# EAGLE design TEMP sensor (EAGLE 9.6.0)
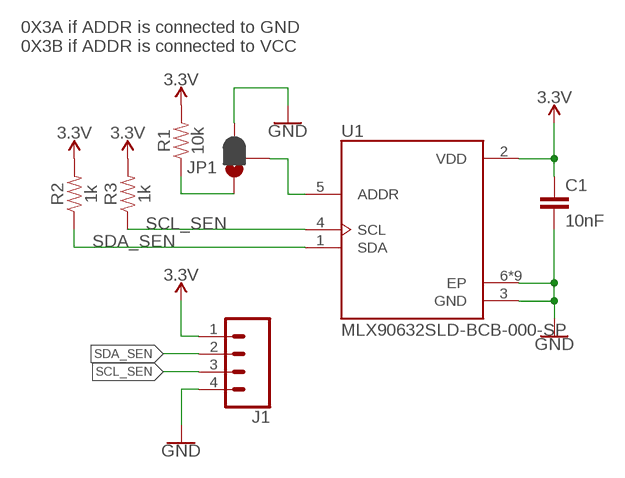
[diagram p0: schematic, sheet 1]

## Parts
C1  10nF  10NF-0603-50V-10%  [0603]
J1  CONN_04  [1X04]
JP1  JUMPER-SMT_3_1-NC_PASTE_SILK  [SMT-JUMPER_3_1-NC_PASTE_SILK]
R1  10k  10KOHM-0603-1/10W-1%  [0603]
R2  1k  1KOHM-0603-1/10W-1%  [0603]
R3  1k  1KOHM-0603-1/10W-1%  [0603]
U1  MLX90632SLD-BCB-000-SP  [XDCR_MLX90632SLD-BCB-000-SP]

## Nets
3.3V: C1.1 J1.1 R1.2 R2.2 R3.2 U1.2(VDD)
GND: C1.2 J1.4 JP1.3 U1.3(GND) U1.6(EP) U1.P$1(EP) U1.P$2(EP) U1.P$3(EP) U1.P$4(EP) U1.P$5(EP) U1.P$6(EP) U1.P$7(EP) U1.P$8(EP)
N$1: JP1.2 U1.5(ADDR)
N$3: JP1.1 R1.1
SCL_SEN: J1.3 R3.1 U1.4(SCL)
SDA_SEN: J1.2 R2.1 U1.1(SDA)

## Notes on the sheet
- 0X3A if ADDR is connected to GND
  0X3B if ADDR is connected to VCC

## Library data of the parts
C1 = SparkFun-Capacitors:10NF: 0.01uF/10nF/10,000pF ceramic capacitors A capacitor is a passive two-terminal electrical component used to store electrical energy temporarily in an electric field. CAP-09321; PROD_ID: CAP-00867
J1 = SparkFun-Connectors:CONN_04: Multi connection point. Often used as Generic Header-pin footprint for 0.1 inch spaced/style header connections On any of the 0.1 inch spaced packages, you can populate with these: Break Away Headers - Straight <https://www.sparkfun.com/products/116> (PRT-00116) Break Away Male Headers - Right Angle <https://www.sparkfun.com/products/553> (PRT-00553) Female Headers <https://www.sparkfun.com/products/115> (PRT-00115) Break Away Headers - Machine Pin <https://www.sparkfun.com/products/117> (PRT-00117) Break Away Female Headers - Swiss Machine Pin <https://www.sparkfun.com/products/743> (PRT-00743) For SCREWTERMINALS and SPRING TERMINALS visit here: Screw Terimnals on SparkFun.com <https://www.sparkfun.com/search/results?term=Screw+Terminals> (5mm/3.5mm/2.54mm spacing) This device is also useful as a general connection point to wire up your design to another part of your project. Our various solder wires solder well into these plated through hole pads. Hook-Up Wire - Assortment (Stranded, 22 AWG) <https://www.sparkfun.com/products/11375> (PRT-11375) Hook-Up Wire - Assortment (Solid Core, 22 AWG) <https://www.sparkfun.com/products/11367> (PRT-11367) View the entire wire category on our website here <https://www.sparkfun.com/categories/141> Special notes: Molex polarized connector foot print use with SKU : PRT-08231 with associated crimp pins and housings. 1MM SMD Version SKU: PRT-10208; PROD_ID: CONN-09696
JP1 = SparkFun-Jumpers:JUMPER-SMT_3_1-NC_PASTE: Normally closed solder jumper (1 of 2 connections) This jumper has an aperture in the stencil to allow solder paste to bridge one of the two connections. One connection is normally closed (NC), while the other is normally open (NO). Wick off the solder to open the connection. Reapply solder to reclose the connection. Apply solder to the other side instead to change the current path.
R1 = SparkFun-Resistors:10KOHM: 10kΩ resistor A resistor is a passive two-terminal electrical component that implements electrical resistance as a circuit element. Resistors act to reduce current flow, and, at the same time, act to lower voltage levels within circuits. - Wikipedia; PROD_ID: RES-00824
R2 R3 = SparkFun-Resistors:1KOHM: 1kΩ resistor A resistor is a passive two-terminal electrical component that implements electrical resistance as a circuit element. Resistors act to reduce current flow, and, at the same time, act to lower voltage levels within circuits. - Wikipedia; PROD_ID: RES-07856
U1 = MLX90632SLD EDITED 6:MLX90632SLD-BCB-000-SP: MLX90632 Surface Mount Miniature Infrared (IR) Thermometer IC; AVAILABILITY: Unavailable; DESCRIPTION: Temperature Sensor Digital, Infrared (IR) -20°C ~ 200°C 5-SFN (3x3); MF: Melexis Technologies; MP: MLX90632SLD-BCB-000-SP; PACKAGE: 5-TFSFN-5 Melexis; PRICE: None

## Board
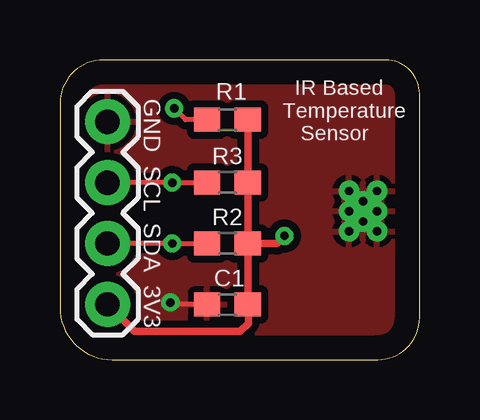
[diagram p1: board, top side]
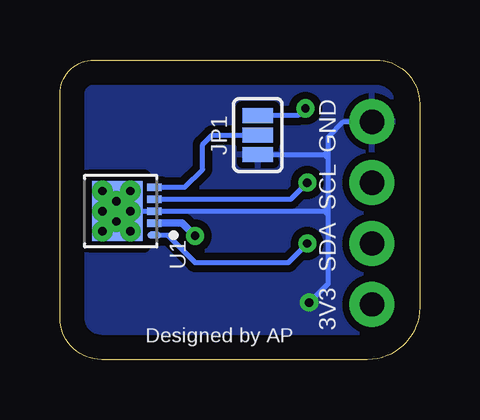
[diagram p2: board, bottom side, seen from below]

Size 15 x 12.5 mm. Coordinates in mm from the lower left corner, seen from the top.
Outline: 0,10.69 0,2.17 arc90 2.17,0 13.26,0 arc90 15,1.74 15,11.08 arc90 13.58,12.5 1.81,12.5 arc90 0,10.69
Copper layers (1*16): Top 0.035mm / dielectric 1.5mm / Bottom 0.035mm
Design rules "default *": minimum track width 6mil, minimum drill 0.35mm, track to track 6mil, track to pad 6mil, pad to pad 6mil, via to via 6mil, smd to smd 6mil, copper to edge 40mil, drill to drill 6mil, minimum pad ring 10mil, minimum via ring 8mil, stop-mask expansion 4mil, vias tented up to drill 15mil, thermal gap 10mil
bRestrict: area 11.5,4.8 to 13.7,4.8; area 11.5,7.5 to 13.7,7.6; area 13.7,4.9 to 13.8,7.5

### Footprints (pad centres in the part's own frame; a part is rotated, then mirrored left to right if it is on the bottom)
0603 = smd 1.1 x 1: 1 -0.85,0; 2 0.85,0
1X04 = drill 1.016 pad 1.88: 1 0,0; 2 2.54,0; 3 5.08,0; 4 7.62,0
SMT-JUMPER_3_1-NC_PASTE_SILK = smd 0.635 x 1.27: 1 -0.813,0; 2 0,0; 3 0.813,0
XDCR_MLX90632SLD-BCB-000-SP = smd 0.6 x 0.3: 1 -1.4,1; 2 -1.4,0.5; 3 -1.4,0; 4 -1.4,-0.5; 5 -1.4,-1 | smd 2.1 x 2.5: 6 0.15,0 | drill 0.35 pad 0.457: P$1 -0.406,0.838; P$2 0.762,0.838; P$3 -0.406,0; P$4 -0.406,-0.838; P$5 0.762,0; P$6 0.762,-0.838; P$7 0.178,0.432; P$8 0.178,-0.406

### Placement (x,y rotation side)
C1  6.99,2.3 180 top
J1  1.98,2.3 90 top
JP1  6.75,9.37 270 bottom
R1  6.99,10 0 top
R2  6.99,4.84 0 top
R3  6.99,7.38 0 top
U1  12.46,6.19 180 bottom

### Tracks (layer width: path | path; a pad name or v marks a point on that pad's centre or on a via)
3.3V  (via drill 0.35)
  Top 0.305: R1.2 R3.2 R2.2 | R2.2 C1.1 7.86,2.28 7.86,1.51 7.52,1.17 3.12,1.17 J1.1 | v9.37,5.16 9.05,4.84 R2.2
  Bottom 0.305: U1.2 9.9,5.69 v9.37,5.16
GND  (via drill 0.35)
  Top 0.203: C1.2 4.68,2.3 v4.6,2.38
  Bottom 0.203: v4.6,2.38 3.81,3.17 3.81,6.03 | 3.81,6.03 3.81,6.19 | 3.81,6.19 3.81,6.35 | 3.97,6.19 U1.3 U1.6 | 3.81,6.19 3.97,6.19 | 3.97,6.19 3.81,6.35 | 3.97,6.19 3.81,6.03 | U1.6 12.61,5.79 U1.P$2 | U1.6 12.66,6.14 U1.P$5 | U1.6 12.61,6.49 U1.P$6 | U1.6 12.56,6.14 U1.P$3 | U1.6 12.05,6.75 U1.P$4 | JP1.3 3.97,8.55 | 3.97,8.55 3.81,8.55 | 3.81,6.35 3.81,8.39 | 3.81,8.39 3.81,8.55 | 3.81,8.55 3.81,8.71 | 3.81,8.71 3.81,9.29 3.17,9.92 J1.4 | 3.97,8.55 3.81,8.39 | 3.97,8.55 3.81,8.71 | U1.P$8 12.61,6.57 U1.6 | U1.6 12.64,6.16 U1.P$7 | U1.6 12.61,5.91 U1.P$1
  pour Bottom (isolate 0.305): 0,12.46 0,0 15,0 15,12.46
  pour Top (isolate 0.305): 0,12.46 0,0 15,0 15,12.46
N$1
  Bottom 0.203: U1.5 9.79,7.19 9.05,7.94 9.05,8.97 8.65,9.37 JP1.2
N$3  (via drill 0.35)
  Top 0.203: R1.1 5.24,10 v4.76,10.48
  Bottom 0.203: v4.76,10.48 5.06,10.18 JP1.1
SCL_SEN  (via drill 0.35)
  Top 0.203: R3.1 v4.68,7.38 J1.3
  Bottom 0.203: U1.4 5.37,6.69 v4.68,7.38
SDA_SEN  (via drill 0.35)
  Top 0.203: R2.1 v4.68,4.84 J1.2
  Bottom 0.203: U1.1 10.51,5.19 9.37,4.05 5.48,4.05 v4.68,4.84

### Text on the board
tPlace: GND | IR Based / Temperature / Sensor | SCL | SDA | 3V3
bPlace: GND | SCL | SDA | 3V3 | Designed by AP